# EAGLE design esp32_master_board (EAGLE 9.4.0)
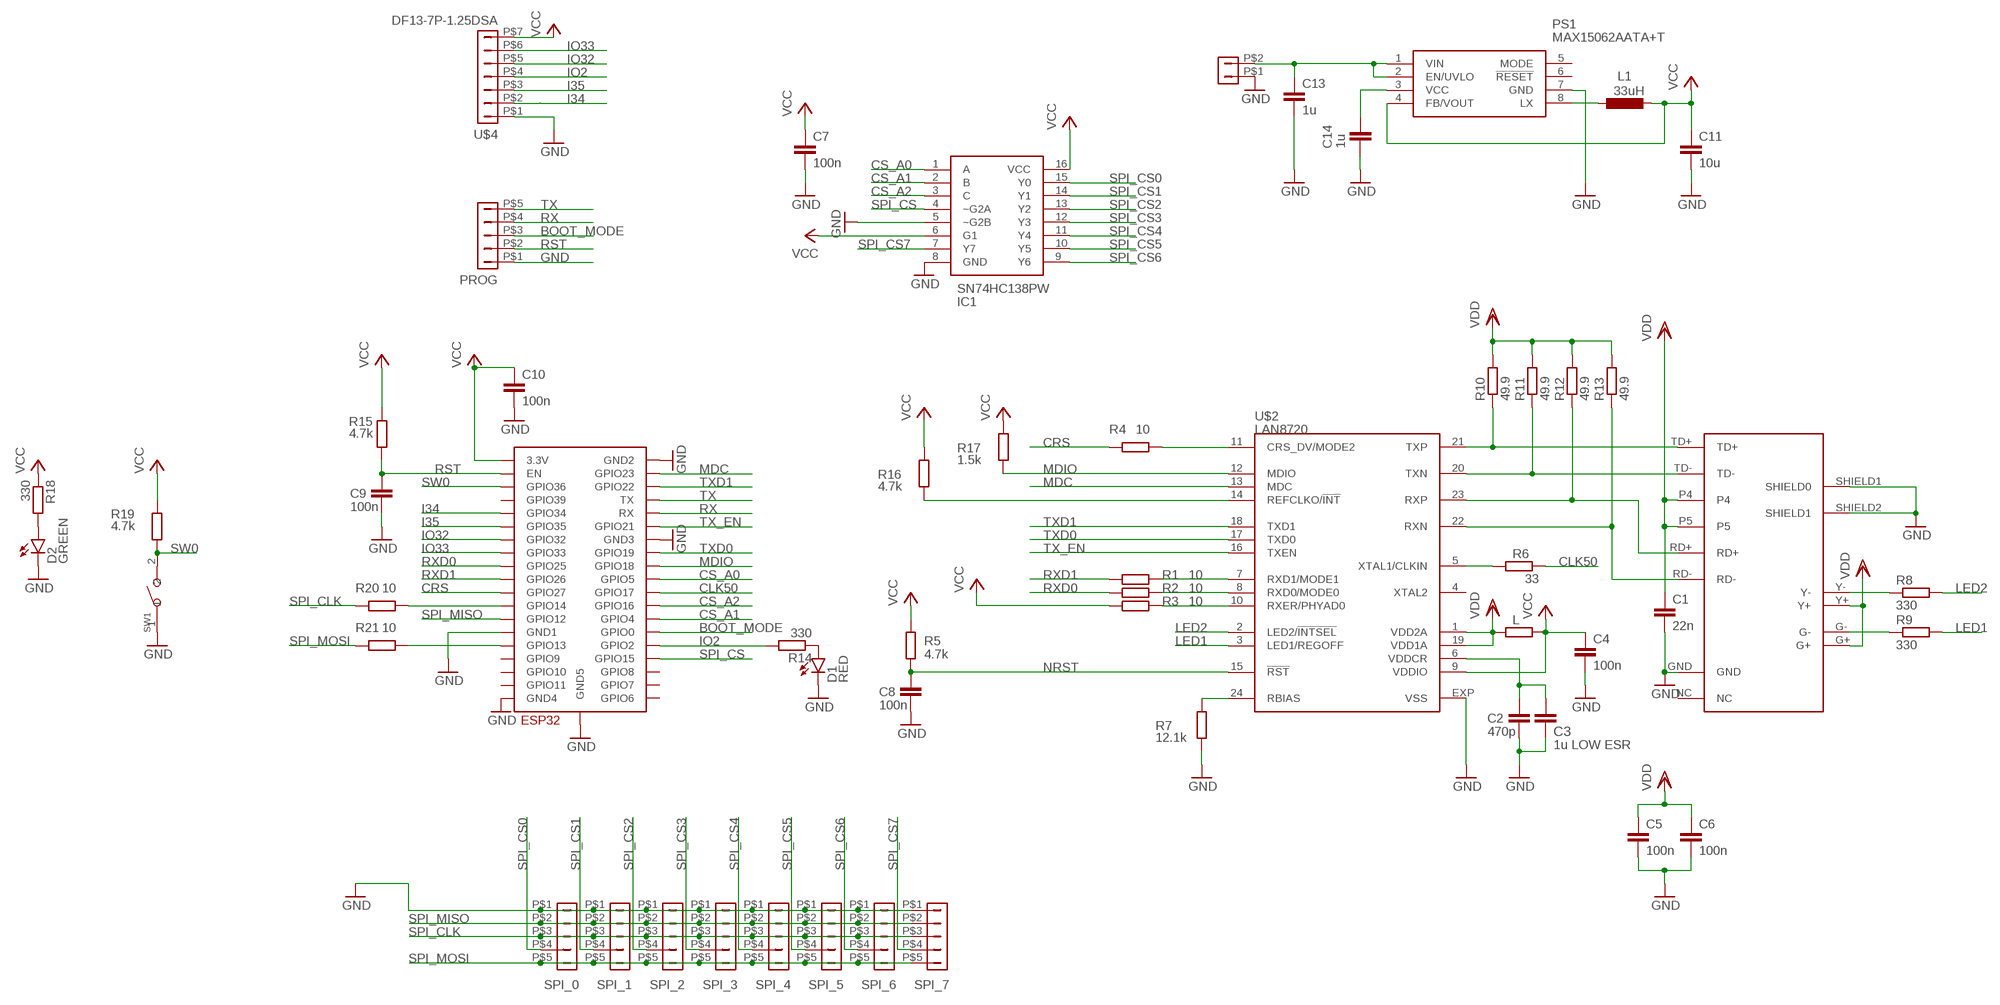
[diagram p0: schematic, sheet 1]

## Parts
C1  22n  C-EUC0402  [C0402]
C2  470p  C-EUC0402  [C0402]
C3  1u LOW ESR  C-EUC0402  [C0402]
C4  100n  C-EUC0402  [C0402]
C5  100n  C-EUC0402  [C0402]
C6  100n  C-EUC0402  [C0402]
C7  100n  C-EUC0402  [C0402]
C8  100n  C-EUC0402  [C0402]
C9  100n  C-EUC0402  [C0402]
C10  100n  C-EUC0805K  [C0805K]
C11  10u  C-EUC0805K  [C0805K]
C13  1u  C-EUC0805K  [C0805K]
C14  1u  C-EUC0402  [C0402]
D1  RED  LEDCHIPLED_0805  [CHIPLED_0805]
D2  GREEN  LEDCHIPLED_0805  [CHIPLED_0805]
IC1  SN74HC138PW  [SOP65P640X120-16N]
L  R-EU_R0402  [R0402]
L1  33uH  L-EUWE-TPC  [POWER-CHOKE_WE-TPC]
POWER  DF13-2P-1.25DSA  [DF13-2P-1.25DSA]
PROG  DF13-5P-1.25DSA  [DF13-5P-1.25DSA]
PS1  MAX15062AATA+T  [MAX14591ETAT]
R1  10  R-EU_R0402  [R0402]
R2  10  R-EU_R0402  [R0402]
R3  10  R-EU_R0402  [R0402]
R4  10  R-EU_R0402  [R0402]
R5  4.7k  R-EU_R0402  [R0402]
R6  33  R-EU_R0402  [R0402]
R7  12.1k  R-EU_R0402  [R0402]
R8  330  R-EU_R0402  [R0402]
R9  330  R-EU_R0402  [R0402]
R10  49.9  R-EU_R0402  [R0402]
R11  49.9  R-EU_R0402  [R0402]
R12  49.9  R-EU_R0402  [R0402]
R13  49.9  R-EU_R0402  [R0402]
R14  330  R-EU_R0402  [R0402]
R15  4.7k  R-EU_R0402  [R0402]
R16  4.7k  R-EU_R0402  [R0402]
R17  1.5k  R-EU_R0402  [R0402]
R18  330  R-EU_R0402  [R0402]
R19  4.7k  R-EU_R0402  [R0402]
R20  10  R-EU_R0402  [R0402]
R21  10  R-EU_R0402  [R0402]
SPI_0  DF13-5P-1.25DSA  [DF13-5P-1.25DSA]
SPI_1  DF13-5P-1.25DSA  [DF13-5P-1.25DSA]
SPI_2  DF13-5P-1.25DSA  [DF13-5P-1.25DSA]
SPI_3  DF13-5P-1.25DSA  [DF13-5P-1.25DSA]
SPI_4  DF13-5P-1.25DSA  [DF13-5P-1.25DSA]
SPI_5  DF13-5P-1.25DSA  [DF13-5P-1.25DSA]
SPI_6  DF13-5P-1.25DSA  [DF13-5P-1.25DSA]
SPI_7  DF13-5P-1.25DSA  [DF13-5P-1.25DSA]
SW1  B3U-1000P-2P-SMD  SMD-BUTTON(2P-3.0X2.5X1.2+0.4MM)-B3U-1000P-2P-SMD  [SW2-2.6-3.0X2.5X1.2+0.4MM]
U$1  ESP32-WROOM  [ESP32-WROOM]
U$2  LAN8720  [QFN24]
U$3  HR911105A  [RJ45]
U$4  DF13-7P-1.25DSA  [DF13-7P-1.25DSA]

## Nets
BOOT_MODE: PROG.P$3 U$1.IO0(GPIO0)
CLK50: R6.1 U$1.IO17(GPIO17)
CRS: R4.1 U$1.IO27(GPIO27)
CS_A0: IC1.1(A) U$1.IO5(GPIO5)
CS_A1: IC1.2(B) U$1.IO4(GPIO4)
CS_A2: IC1.3(C) U$1.IO16(GPIO16)
GND: C1.2 C2.2 C3.2 C4.2 C5.2 C6.2 C7.2 C8.2 C9.2 C10.2 C11.2 C13.2 C14.1 D1.C D2.C IC1.5(~G2B) IC1.8(GND) POWER.P$1 PROG.P$1 PS1.7(GND) R7.1 SPI_0.P$1 SPI_1.P$1 SPI_2.P$1 SPI_3.P$1 SPI_4.P$1 SPI_5.P$1 SPI_6.P$1 SPI_7.P$1 SW1.1 U$1.GND1 U$1.GND2 U$1.GND3 U$1.GND4 U$1.GND5 U$2.EXP(VSS) U$3.GND U$3.SHIELD1(SHIELD0) U$3.SHIELD2(SHIELD1) U$4.P$1
I34: U$1.IO34(GPIO34) U$4.P$2
I35: U$1.IO35(GPIO35) U$4.P$3
IO2: R14.2 U$1.IO2(GPIO2) U$4.P$4
IO32: U$1.IO32(GPIO32) U$4.P$5
IO33: U$1.IO33(GPIO33) U$4.P$6
LED1: R9.2 U$2.3(LED1/REGOFF)
LED2: R8.2 U$2.2(LED2/!INTSEL)
MDC: U$1.IO23(GPIO23) U$2.13(MDC)
MDIO: R17.1 U$1.IO18(GPIO18) U$2.12(MDIO)
N$1: R1.2 U$2.7(RXD1/MODE1)
N$2: R2.2 U$2.8(RXD0/MODE0)
N$3: R3.2 U$2.10(RXER/PHYAD0)
N$4: R4.2 U$2.11(CRS_DV/MODE2)
N$5: R6.2 U$2.5(XTAL1/CLKIN)
N$6: R7.2 U$2.24(RBIAS)
N$7: R10.1 U$2.21(TXP) U$3.TD+
N$8: R11.1 U$2.20(TXN) U$3.TD-
N$9: R12.1 U$2.23(RXP) U$3.RD+
N$10: R13.1 U$2.22(RXN) U$3.RD-
N$11: R8.1 U$3.Y-
N$12: R9.1 U$3.G-
N$13: R16.1 U$2.14(REFCLKO/!INT)
N$14: C2.1 C3.1 U$2.6(VDDCR)
N$15: C14.2 PS1.3(VCC)
N$16: D1.A R14.1
N$17: R21.2 U$1.IO13(GPIO13)
N$18: L1.1 PS1.8(LX)
N$19: C13.1 POWER.P$2 PS1.1(VIN) PS1.2(EN/UVLO)
N$20: D2.A R18.2
N$21: R20.2 U$1.IO14(GPIO14)
NRST: C8.1 R5.1 U$2.15(!RST)
RST: C9.1 PROG.P$2 R15.1 U$1.EN
RX: PROG.P$4 U$1.RX
RXD0: R2.1 U$1.IO25(GPIO25)
RXD1: R1.1 U$1.IO26(GPIO26)
SPI_CLK: R20.1 SPI_0.P$3 SPI_1.P$3 SPI_2.P$3 SPI_3.P$3 SPI_4.P$3 SPI_5.P$3 SPI_6.P$3 SPI_7.P$3
SPI_CS: IC1.4(~G2A) U$1.IO15(GPIO15)
SPI_CS0: IC1.15(Y0) SPI_0.P$4
SPI_CS1: IC1.14(Y1) SPI_1.P$4
SPI_CS2: IC1.13(Y2) SPI_2.P$4
SPI_CS3: IC1.12(Y3) SPI_3.P$4
SPI_CS4: IC1.11(Y4) SPI_4.P$4
SPI_CS5: IC1.10(Y5) SPI_5.P$4
SPI_CS6: IC1.9(Y6) SPI_6.P$4
SPI_CS7: IC1.7(Y7) SPI_7.P$4
SPI_MISO: SPI_0.P$2 SPI_1.P$2 SPI_2.P$2 SPI_3.P$2 SPI_4.P$2 SPI_5.P$2 SPI_6.P$2 SPI_7.P$2 U$1.IO12(GPIO12)
SPI_MOSI: R21.1 SPI_0.P$5 SPI_1.P$5 SPI_2.P$5 SPI_3.P$5 SPI_4.P$5 SPI_5.P$5 SPI_6.P$5 SPI_7.P$5
SW0: R19.1 SW1.2 U$1.SENSOR_VP(GPIO36)
TX: PROG.P$5 U$1.TX
TX_EN: U$1.IO21(GPIO21) U$2.16(TXEN)
TXD0: U$1.IO19(GPIO19) U$2.17(TXD0)
TXD1: U$1.IO22(GPIO22) U$2.18(TXD1)
VCC [power]: C4.1 C7.1 C10.1 C11.1 IC1.6(G1) IC1.16(VCC) L1.2 L.1 PS1.4(FB/VOUT) R3.1 R5.2 R15.2 R16.2 R17.2 R18.1 R19.2 U$1.3V3(3.3V) U$2.9(VDDIO) U$4.P$7
VDD [power]: C1.1 C5.1 C6.1 L.2 R10.2 R11.2 R12.2 R13.2 U$2.1(VDD2A) U$2.19(VDD1A) U$3.G+ U$3.P4 U$3.P5 U$3.Y+
Unconnected: PS1.5(MODE) PS1.6(!RESET) U$1.CLK(GPIO6) U$1.CMD(GPIO11) U$1.SD0(GPIO7) U$1.SD1(GPIO8) U$1.SD2(GPIO9) U$1.SD3(GPIO10) U$1.SENSOR_VN(GPIO39) U$2.4(XTAL2) U$3.NC

## Library data of the parts
C1-C11 C13 C14 = resistor:C-EU: CAPACITOR, European symbol
D1 D2 = led:LED: LED OSRAM: - CHIPLED LG R971, LG N971, LY N971, LG Q971, LY Q971, LO R971, LY R971 LH N974, LH R974 LS Q976, LO Q976, LY Q976 LO Q996 - Hyper CHIPLED LW Q18S LB Q993, LB Q99A, LB R99A - SideLED LS A670, LO A670, LY A670, LG A670, LP A670 LB A673, LV A673, LT A673, LW A673 LH A674 LY A675 LS A676, LA A676, LO A676, LY A676, LW A676 LS A679, LY A679, LG A679 - Hyper Micro SIDELED® LS Y876, LA Y876, LO Y876, LY Y876 LT Y87S - SmartLED LW L88C, LW L88S LB L89C, LB L89S, LG L890 LS L89K, LO L89K, LY L89K LS L896, LA L896, LO L896, LY L896 - TOPLED LS T670, LO T670, LY T670, LG T670, LP T670 LSG T670, LSP T670, LSY T670, LOP T670, LYG T670 LG T671, LOG T671, LSG T671 LB T673, LV T673, LT T673, LW T673 LH T674 LS T676, LA T676, LO T676, LY T676, LB T676, LH T676, LSB T676, LW T676 LB T67C, LV T67C, LT T67C, LS T67K, LO T67K, LY T67K, LW E67C LS E67B, LA E67B, LO E67B, LY E67B, LB E67C, LV E67C, LT E67C LW T67C LS T679, LY T679, LG T679 LS T770, LO T770, LY T770, LG T770, LP T770 LB T773, LV T773, LT T773, LW T773 LH T774 LS E675, LA E675, LY E675, LS T675 LS T776, LA T776, LO T776, LY T776, LB T776 LHGB T686 LT T68C, LB T68C - Hyper Mini TOPLED® LB M676 - Mini TOPLED Santana® LG M470 LS M47K, LO M47K, LY M47K Source: http://www.osram.convergy.de LUXEON: - LUMILED® LXK2-PW12-R00, LXK2-PW12-S00, LXK2-PW14-U00, LXK2-PW14-V00 LXK2-PM12-R00, LXK2-PM12-S00, LXK2-PM14-U00 LXK2-PE12-Q00, LXK2-PE12-R00, LXK2-PE12-S00, LXK2-PE14-T00, LXK2-PE14-U00 LXK2-PB12-K00, LXK2-PB12-L00, LXK2-PB12-M00, LXK2-PB14-N00, LXK2-PB14-P00, LXK2-PB14-Q00 LXK2-PR12-L00, LXK2-PR12-M00, LXK2-PR14-Q00, LXK2-PR14-R00 LXK2-PD12-Q00, LXK2-PD12-R00, LXK2-PD12-S00 LXK2-PH12-R00, LXK2-PH12-S00 LXK2-PL12-P00, LXK2-PL12-Q00, LXK2-PL12-R00 Source: www.luxeon.com KINGBRIGHT: KA-3528ASYC Source: www.kingbright.com
IC1 = SamacSys_Parts:SN74HC138PW: Texas Instruments SN74HC138PW, Decoder, Demultiplexer, 1-of-8, Inverting, 2 6 V, 16-Pin TSSOP Source: Datasheet <http://www.ti.com/lit/gpn/sn74hc138>; DESCRIPTION: Texas Instruments SN74HC138PW, Decoder, Demultiplexer, 1-of-8, Inverting, 2 6 V, 16-Pin TSSOP; HEIGHT: mm; MANUFACTURER_NAME: Texas Instruments; MANUFACTURER_PART_NUMBER: SN74HC138PW; RS_PART_NUMBER: 6631928; RS_PRICE-STOCK: https://uk.rs-online.com/web/p/products/6631928
L R1-R21 = resistor:R-EU_: RESISTOR, European symbol
L1 = resistor:L-EU: INDUCTOR, European symbol
POWER = con-hirose-df13:DF13-2P-1.25: DF13-2P 1.25mm Pitch Miniature Crimping Connector.
PROG SPI_0 SPI_1-SPI_7 = con-hirose-df13:DF13-5P-1.25: DF13-5P 1.25mm Pitch Miniature Crimping Connector.
PS1 = MAX15062AATA:MAX15062AATA+T: MAXIM INTEGRATED PRODUCTS - MAX15062AATA+T - DC/DC CTRL, SYNC BUCK, 500KHZ, TDFN-8 Source: Datasheet <https://componentsearchengine.com/Datasheets/1/MAX15062AATA T.pdf>; DESCRIPTION: MAXIM INTEGRATED PRODUCTS - MAX15062AATA+T - DC/DC CTRL, SYNC BUCK, 500KHZ, TDFN-8; HEIGHT: 0mm; MANUFACTURER_NAME: Maxim Integrated; MANUFACTURER_PART_NUMBER: MAX15062AATA+T; MOUSER_PART_NUMBER: 700-MAX15062AATA+T; MOUSER_PRICE-STOCK: https://www.mouser.com/Search/Refine.aspx?Keyword=700-MAX15062AATA%2BT
SW1 = OPL_Switch:SMD-BUTTON(2P-3.0X2.5X1.2+0.4MM): 311020047; MPN: B3U-1000P-2P-SMD
U$1 = ESP32:ESP32-WROOM
U$2 = microchip-smsc-lan8720:LAN8720: LAN8720A/LAN8720Ai Small Footprint RMII 10/100 Ethernet PHY Transceiver with HP Auto-MDIX Support from SMSC / Microchip <http://www.microchip.com>. (C) 2014 Tomasz Boleslaw CEDRO, cederom@tlen.pl, http://www.tomek.cedro.info. Version 0.1 (2014-01-04): Initial release.
U$3 = HR911105A:HR911105A
U$4 = con-hirose-df13:DF13-7P-1.25: DF13-7P 1.25mm Pitch Miniature Crimping Connector.

## Net classes
1 power: width 0.406 mm

## Board
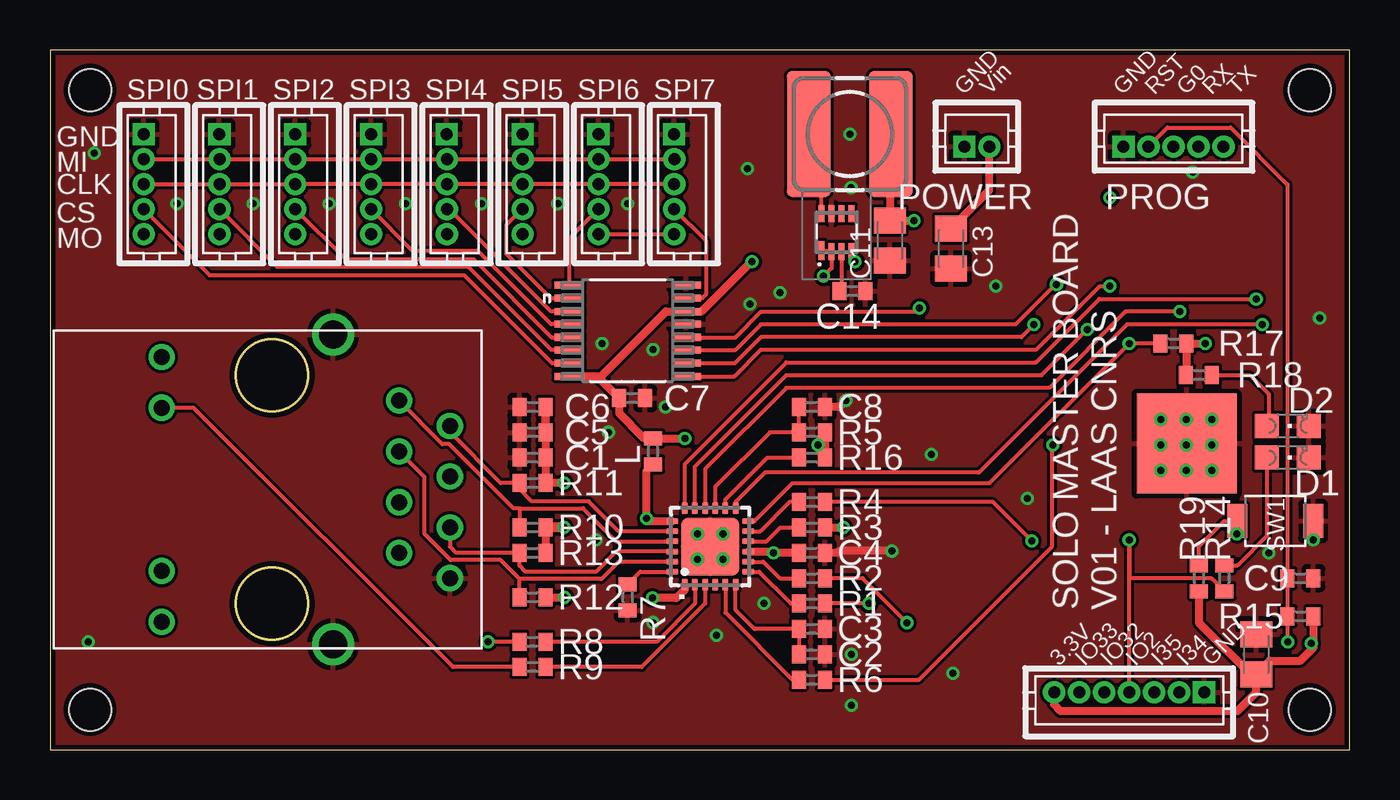
[diagram p1: board, top side]
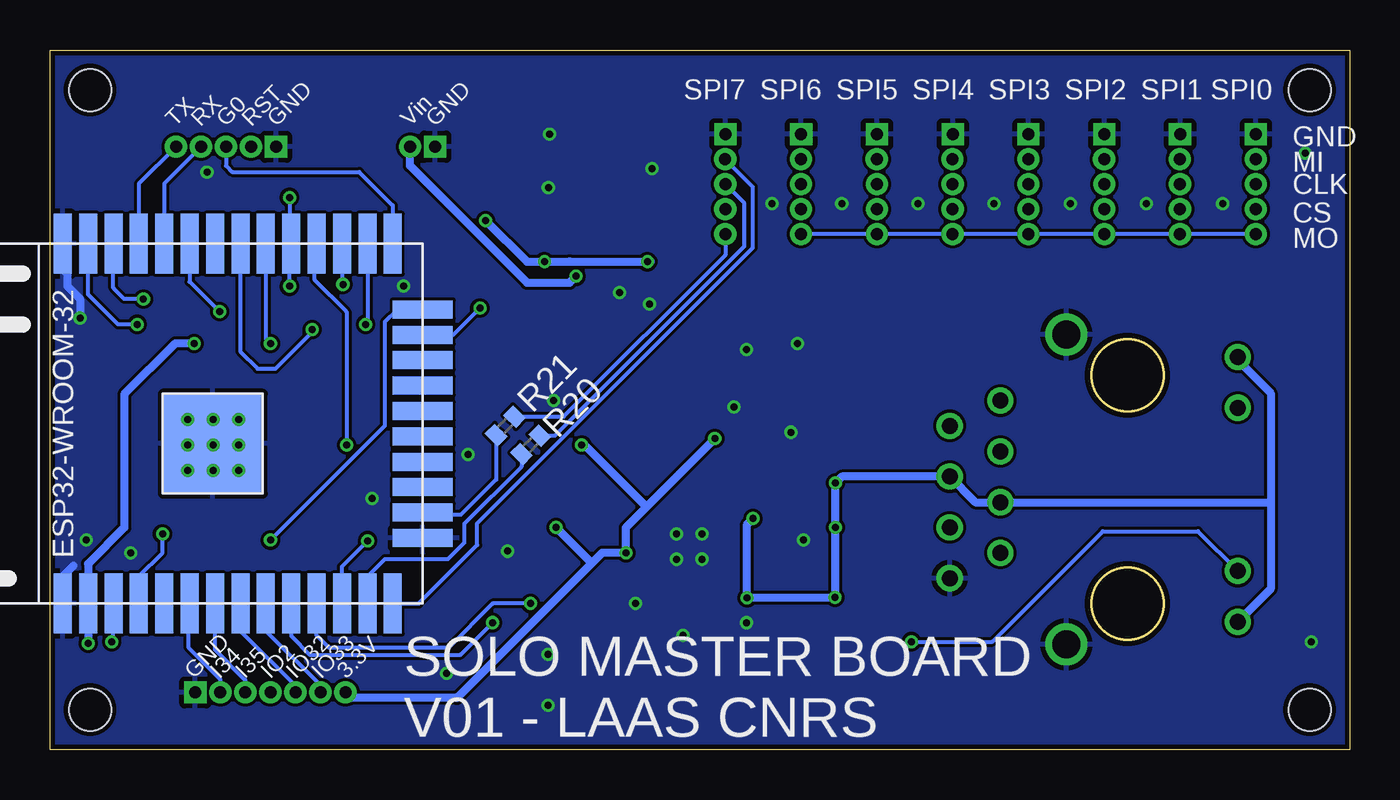
[diagram p2: board, bottom side, seen from below]

Size 65 x 35 mm. Coordinates in mm from the lower left corner, seen from the top.
Outline: 0,0 65,0 65,35 0,35 0,0
Copper layers (1*16): Top 0.035mm / dielectric 1.5mm / Bottom 0.035mm
Design rules "SeeedStudio": minimum track width 6mil, minimum drill 12mil, track to track 6mil, track to pad 6mil, pad to pad 6mil, via to via 6mil, smd to smd 0mil, copper to edge 10mil, drill to drill 10mil, minimum pad ring 10mil, minimum via ring 6mil, stop-mask expansion 2mil, vias tented up to drill 100mil, thermal gap 10mil
Holes 2.1 mm at 2,33 2,2 63,2 63,33

### Footprints (pad centres in the part's own frame; a part is rotated, then mirrored left to right if it is on the bottom)
C0402 = smd 0.7 x 0.9: 1 -0.65,0; 2 0.65,0
C0805K = smd 1.3 x 1.6: 1 -1,0; 2 1,0
CHIPLED_0805 = smd 1.2 x 1.2: A 0,-1.05; C 0,1.05
SOP65P640X120-16N = smd 1.473 x 0.356: 1 -2.921,2.286; 2 -2.921,1.626; 3 -2.921,0.965; 4 -2.921,0.33; 5 -2.921,-0.33; 6 -2.921,-0.965; 7 -2.921,-1.626; 8 -2.921,-2.286; 9 2.921,-2.286; 10 2.921,-1.626; 11 2.921,-0.965; 12 2.921,-0.33; 13 2.921,0.33; 14 2.921,0.965; 15 2.921,1.626; 16 2.921,2.286
R0402 = smd 0.7 x 0.9: 1 -0.65,0; 2 0.65,0
POWER-CHOKE_WE-TPC = smd 6.3 x 2.2: 1 0,2.05; 2 0,-2.05
DF13-2P-1.25DSA = drill 0.6 pad 1.016 square: P$1 0.625,0 | drill 0.6 pad 1.016: P$2 -0.625,0
DF13-5P-1.25DSA = drill 0.6 pad 1.016 square: P$1 2.5,0.005 | drill 0.6 pad 1.016: P$2 1.25,-0.005; P$3 0,0; P$4 -1.25,0; P$5 -2.5,0
MAX14591ETAT = smd 0.3 x 0.95: 1 -0.75,-0.762 | smd 0.3 x 0.85: 2 -0.25,-0.812; 3 0.25,-0.812; 4 0.75,-0.812; 5 0.75,1.088; 6 0.25,1.088; 7 -0.25,1.088; 8 -0.75,1.088
SW2-2.6-3.0X2.5X1.2+0.4MM = smd 1 x 1.7: 1 -1.9,0; 2 1.9,0
ESP32-WROOM = smd 3 x 0.9: 3V3 0,16.74; EN 0,15.47; GND1 0,18.01; GND3 18,18.01; IO0 18,1.5; IO4 18,2.77; IO5 18,6.58; IO12 0,1.5; IO14 0,2.77; IO16 18,4.04; IO17 18,5.31; IO18 18,7.85; IO19 18,9.12; IO21 18,11.66; IO22 18,15.47; IO23 18,16.74; IO25 0,6.58; IO26 0,5.31; IO27 0,4.04; IO32 0,9.12; IO33 0,7.85; IO34 0,11.66; IO35 0,10.39; NC 18,10.39; RX 18,12.93; SENSOR_VN 0,12.93; SENSOR_VP 0,14.2; TX 18,14.2 | smd 0.9 x 3: CLK 9.635,0; CMD 8.365,0; GND2 3.285,0; IO2 14.715,0; IO13 4.555,0; IO15 13.445,0; SD0 10.905,0; SD1 12.175,0; SD2 5.825,0; SD3 7.095,0 | smd 5 x 5: GND4 8,10.5 | smd 5 x 5 bottom: GND5 8,10.5
QFN24 = smd 0.6 x 0.3: 1 -1.905,1.27; 2 -1.905,0.762; 3 -1.905,0.254; 4 -1.905,-0.254; 5 -1.905,-0.762; 6 -1.905,-1.27; 13 1.905,-1.27; 14 1.905,-0.762; 15 1.905,-0.254; 16 1.905,0.254; 17 1.905,0.762; 18 1.905,1.27 | smd 0.3 x 0.6: 7 -1.27,-1.905; 8 -0.762,-1.905; 9 -0.254,-1.905; 10 0.254,-1.905; 11 0.762,-1.905; 12 1.27,-1.905; 19 1.27,1.905; 20 0.762,1.905; 21 0.254,1.905; 22 -0.254,1.905; 23 -0.762,1.905; 24 -1.27,1.905 | smd 2.9 x 2.9: EXP 0,0
RJ45 = drill 0.8: G+ 5.84,-6.305; G- 5.84,-3.765; GND -8.57,4.76; NC -6.03,3.5; P4 -8.57,-0.32; P5 -6.03,0.96; RD+ -6.03,-1.58; RD- -8.57,2.22; TD+ -6.03,-4.12; TD- -8.57,-2.86; Y+ 5.84,6.945; Y- 5.84,4.405 | drill 1.4: SHIELD1 -2.73,-7.425; SHIELD2 -2.73,8.065
DF13-7P-1.25DSA = drill 0.6 pad 1.016 square: P$1 3.75,0 | drill 0.6 pad 1.016: P$2 2.5,0; P$3 1.25,0; P$4 0,0; P$5 -1.25,0; P$6 -2.5,0; P$7 -3.75,0

### Placement (x,y rotation side)
C1  24.13,14.61 180 top
C2  38.1,4.76 0 top
C3  38.1,6.03 0 top
C4  38.1,9.84 0 top
C5  24.13,15.88 180 top
C6  24.13,17.14 180 top
C7  29.11,17.58 0 top
C8  38.1,17.14 0 top
C9  62.55,8.57 0 top
C10  60.33,4.76 90 top
C11  42.01,25.47 270 top
C13  45.07,25.07 270 top
C14  40.14,22.94 180 top
D1  61.91,14.61 270 top
D2  61.91,16.19 270 top
IC1  28.89,20.95 180 top
L  30.16,14.92 270 top
L1  40.01,30.8 90 top
POWER  46.35,30.16 180 top
PROG  56.2,30.16 180 top
PS1  39.34,25.74 0 top
R1  38.1,7.3 180 top
R2  38.1,8.57 180 top
R3  38.1,11.11 180 top
R4  38.1,12.38 180 top
R5  38.1,15.88 0 top
R6  38.1,3.49 180 top
R7  28.89,7.62 90 top
R8  24.13,5.4 0 top
R9  24.13,4.13 0 top
R10  24.13,11.11 0 top
R11  24.13,13.34 0 top
R12  24.13,7.62 0 top
R13  24.13,9.84 0 top
R14  58.74,8.57 270 top
R15  62.55,6.67 0 top
R16  38.1,14.61 0 top
R17  56.2,20.32 0 top
R18  57.47,18.73 0 top
R19  57.47,8.57 270 top
R20  40.96,15.24 225 bottom
R21  42.23,16.19 225 bottom
SPI_0  4.69,28.28 90 top
SPI_1  8.48,28.28 90 top
SPI_2  12.27,28.28 90 top
SPI_3  16.06,28.28 90 top
SPI_4  19.85,28.28 90 top
SPI_5  23.64,28.28 90 top
SPI_6  27.43,28.28 90 top
SPI_7  31.22,28.28 90 top
SW1  61.28,11.43 180 top
U$1  46.35,7.3 90 bottom
U$2  33.02,10.16 90 top
U$3  11.43,13.34 180 top
U$4  53.98,2.86 0 top

### Tracks (layer width: path | path; a pad name or v marks a point on that pad's centre or on a via)
BOOT_MODE
  Bottom 0.203: PROG.P$3 56.2,29.21 55.88,28.89 49.53,28.89 47.85,27.22 U$1.IO0
CLK50  (via drill 0.35)
  Top 0.203: v50.16,15.24 50.13,15.21 50.13,10.17 43.46,3.49 R6.1
  Bottom 0.203: v50.16,15.24 50.16,21.91 51.75,23.5 51.75,25.21 U$1.IO17
CRS  (via drill 0.35)
  Top 0.203: R4.1 47.17,12.38 v49.11,10.45
  Bottom 0.203: v49.11,10.45 50.4,9.16 U$1.IO27
CS_A0  (via drill 0.35)
  Top 0.203: IC1.1 34.23,18.67 35.56,20 49.33,20 52.5,23.18 v53.02,23.18
  Bottom 0.203: v53.02,27.62 53.02,25.39 U$1.IO5 53.02,25.21 v53.02,23.18
CS_A1  (via drill 0.35)
  Top 0.203: IC1.2 34.25,19.33 35.56,20.64 48.58,20.64 v49.21,21.27
  Bottom 0.203: U$1.IO4 49.12,21.36 v49.21,21.27
CS_A2  (via drill 0.35)
  Top 0.203: IC1.3 34.28,19.99 35.56,21.27 48.29,21.27 50.29,23.27 v50.35,23.27
  Bottom 0.203: U$1.IO16 50.4,23.32 v50.35,23.27
GND  (via drill 0.35)
  Top 0.406: U$2.EXP v32.38,10.79 | U$2.EXP v33.66,9.53 | U$2.EXP v32.38,9.53 | U$2.EXP v33.66,10.79 | v42.11,9.93 39.47,9.93 39.38,9.84 C4.2 | v39.81,17.46 39.49,17.14 C8.2
  Bottom 0.203: U$1.GND1 64.36,8.66 | U$1.GND3 64.36,24.04 | U$1.GND4 56.9,15.3 v58.1,16.51 | U$1.GND4 55.65,16.51 v55.56,16.51 | U$1.GND4 55.56,14.01 v55.56,13.97 | U$1.GND4 58.1,14.05 v58.1,13.97
  Bottom 0.406: 64.36,8.66 63.82,9.21 | 64.36,24.04 64.14,23.81 64.14,23.18 63.5,22.54 v63.5,21.59
  other vias: 56.83,15.24 56.83,16.51 55.56,15.24 56.83,13.97 58.1,15.24 47.31,23.18 63.18,10.48 57.15,28.89 34.89,29.06 40.01,30.8 2.22,29.84 1.91,5.4 33.34,5.71 27.62,20.32 27.94,15.88 35.01,22.29 30.8,17.14 60.96,9.84 27.3,10.48 36.51,22.86 40.07,28.11 40.08,4.76 48.88,12.55 44.08,14.76 6.35,27.3 10.16,27.3 13.97,27.3 17.78,27.3 21.59,27.3 25.4,27.3 28.89,27.3 35.72,7.3 30.16,6.35 40.08,2.22 45.16,3.8 30.16,20
  pour Top: 0,35 65,35 65,0 0,0
  pour Bottom: 0,35 65,35 65,0 0,0
I34
  Bottom 0.203: U$4.P$2 56.48,3.51 58.08,5.12 58.08,7.23 U$1.IO34
I35
  Bottom 0.203: U$4.P$3 55.23,3.47 56.74,4.99 U$1.IO35
IO2  (via drill 0.35)
  Top 0.203: R14.2 58.1,8.56 53.98,8.56 v53.98,10.48 53.95,10.48 53.95,2.88 U$4.P$4
  Bottom 0.203: U$1.IO2 47.62,22.02 48.26,21.38 48.26,16.19 v53.98,10.48
IO32
  Bottom 0.203: U$1.IO32 55.48,5.95 52.73,3.2 U$4.P$5
IO33
  Bottom 0.203: U$1.IO33 54.2,5.95 51.48,3.22 U$4.P$6
LED1
  Top 0.203: U$2.3 32.77,7.3 29.59,4.13 R9.2
LED2
  Top 0.203: U$2.2 32.26,7.3 30.35,5.4 R8.2
MDC  (via drill 0.35)
  Top 0.203: v60.64,21.27 53.87,21.27 46.46,13.86 35.76,13.86 34.29,12.38 U$2.13
  Bottom 0.203: v60.64,21.27 61.59,21.27 63.09,22.77 U$1.IO23
MDIO  (via drill 0.35)
  Top 0.203: U$2.12 35.24,11.43 37.15,13.34 46.99,13.34 v53.98,20.32 R17.1
  Bottom 0.203: U$1.IO18 54.2,20.55 v53.98,20.32
N$1
  Top 0.203: R1.2 37.05,7.3 35.47,8.89 U$2.7
N$2
  Top 0.203: U$2.8 35.69,9.4 36.51,8.57 R2.2
N$3
  Top 0.203: U$2.10 35.84,10.41 36.54,11.11 R3.2
N$4
  Top 0.203: U$2.11 35.53,10.92 36.99,12.38 R4.2
N$5
  Top 0.203: R6.2 37.15,3.49 33.78,6.86 U$2.5
N$6
  Top 0.203: R7.2 29.51,8.89 U$2.24
N$7
  Top 0.203: U$2.21 28.32,10.41 26.67,12.06 23.5,12.06 | 23.5,12.06 23.5,11.13 R10.1 | 23.5,12.06 23.18,12.06 19.96,15.29 19.62,15.29 U$3.TD+
N$8
  Top 0.203: U$2.20 28.45,10.92 26.95,12.42 24.09,12.42 23.48,13.03 R11.1 22.54,13.34 20,15.88 U$3.TD-
N$9
  Top 0.203: U$2.23 28.45,9.4 27.58,8.53 23.5,8.53 | U$3.RD+ 18.73,13.64 18.73,10.79 20.04,9.48 22.54,9.48 23.5,8.53 | R12.1 23.5,7.63 23.5,8.53
N$10
  Top 0.203: U$2.22 28.32,9.91 27.31,8.89 23.8,8.89 23.48,9.21 R13.1 20.32,9.84 20,10.16 U$3.RD-
N$11  (via drill 0.35)
  Top 0.203: R8.1 v21.91,5.4
  Bottom 0.203: v21.91,5.4 17.86,5.4 12.35,10.92 7.58,10.92 U$3.Y-
N$12
  Top 0.203: R9.1 20.15,4.13 7.18,17.1 U$3.G-
N$13
  Top 0.203: U$2.14 33.78,12.51 35.88,14.61 R16.1
N$14
  Top 0.203: C2.1 C3.1 35.24,6.03 34.29,6.99 U$2.6
N$15
  Top 0.203: C14.2 39.59,23.04 PS1.3
N$16
  Top 0.203: D1.A 60.86,10.68 59.4,9.22 R14.1
N$17
  Bottom 0.203: R21.2 42.69,13.51 44.45,11.75 46.24,11.75 U$1.IO13
N$18
  Top 0.203: PS1.8 38.59,30.16
  Top 0.406: 38.59,30.16 L1.1
N$19  (via drill 0.35)
  Top 0.203: v38.69,23.68 39.09,24.08 PS1.2 39.04,24.98 PS1.1
  Top 0.406: C13.1 46.98,27.98 POWER.P$2
  Bottom 0.406: v38.69,23.68 39.01,23.36 41.14,23.36 46.99,29.21 POWER.P$2
N$20
  Top 0.203: D2.A 60.96,16.29 60.96,17.78 60.01,18.73 R18.2
N$21
  Bottom 0.203: R20.2 41.42,14.14 44.28,11.28 44.28,10.35 45.11,9.53 48.26,9.53 49.12,8.66 U$1.IO14
NRST
  Top 0.203: C8.1 R5.1 36.01,15.88 33.27,13.14 U$2.15
RST  (via drill 0.35)
  Top 0.203: PROG.P$2 55.9,31.11 59.05,31.11 61.9,28.27 C9.1 R15.1 61.9,5.41
  Top 0.406: 61.9,5.41 v61.91,5.4
  Bottom 0.203: 61.83,5.49 U$1.EN
  Bottom 0.406: v61.91,5.4 61.83,5.49
RX
  Bottom 0.203: PROG.P$4 59.28,28.32 U$1.RX
RXD0  (via drill 0.35)
  Top 0.203: R2.1 40.64,8.57 v42.86,6.35
  Bottom 0.203: v42.86,6.35 44.47,4.74 52,4.74 52.94,5.68 U$1.IO25
RXD1  (via drill 0.35)
  Top 0.203: v40.96,7.3 R1.1
  Bottom 0.203: v40.96,7.3 42.86,7.3 45.07,5.1 51.05,5.1 51.66,5.71 U$1.IO26
SPI_CLK
  Top 0.203: SPI_7.P$3 SPI_6.P$3 SPI_5.P$3 SPI_4.P$3 SPI_3.P$3 SPI_2.P$3 SPI_1.P$3 SPI_0.P$3
  Bottom 0.203: SPI_7.P$3 30.27,27.33 30.27,25.19 39.76,15.7 R20.1
SPI_CS  (via drill 0.35)
  Top 0.203: IC1.4 34.28,20.62 35.56,21.91 43.5,21.91 v43.5,22.09
  Bottom 0.203: v43.5,22.09 44.87,20.72 46.32,20.72 U$1.IO15
SPI_CS0
  Top 0.203: IC1.15 25.12,19.33 20.72,23.73 7.99,23.73 SPI_0.P$4
SPI_CS1
  Top 0.203: IC1.14 25.09,19.99 20.91,24.17 11.34,24.17 SPI_1.P$4
SPI_CS2
  Top 0.203: IC1.13 25.09,20.62 21.2,24.52 14.78,24.52 SPI_2.P$4
SPI_CS3
  Top 0.203: IC1.12 25.07,21.29 21.38,24.98 18.12,24.98 SPI_3.P$4
SPI_CS4
  Top 0.203: IC1.11 25.07,21.92 19.96,27.03 SPI_4.P$4
SPI_CS5
  Top 0.203: IC1.10 25.04,22.58 22.83,24.79 22.83,26.25 23.61,27.03 SPI_5.P$4
SPI_CS6
  Top 0.203: SPI_6.P$4 25.97,25.57 IC1.9
SPI_CS7
  Top 0.203: IC1.7 32.61,22.58 32.8,22.77 32.8,25.45 SPI_7.P$4
SPI_MISO
  Top 0.203: SPI_0.P$2 SPI_1.P$2 SPI_2.P$2 SPI_3.P$2 SPI_4.P$2 SPI_5.P$2 SPI_6.P$2 SPI_7.P$2
  Bottom 0.203: U$1.IO12 46.56,7.3 43.63,10.23 43.63,11.32 29.84,25.11 29.84,28.14 SPI_7.P$2
SPI_MOSI
  Top 0.203: SPI_6.P$5 SPI_7.P$5
  Bottom 0.203: SPI_0.P$5 SPI_1.P$5 SPI_2.P$5 SPI_3.P$5 SPI_4.P$5 SPI_5.P$5 SPI_6.P$5 | SPI_7.P$5 31.22,24.74 39.31,16.65 R21.1
SW0  (via drill 0.35)
  Top 0.203: R19.1 57.47,10.16 58.74,11.43 SW1.2 v59.38,10.8 v59.37,10.79
  Bottom 0.203: U$1.SENSOR_VP 60.55,8.66 59.37,9.84 v59.37,10.79
TX
  Bottom 0.203: PROG.P$5 60.55,28.3 U$1.TX
TX_EN  (via drill 0.35)
  Top 0.203: U$2.16 32.77,14.03 36.83,18.1 49.99,18.1 53.8,21.91 v56.52,21.91
  Bottom 0.203: v56.52,21.91 58.02,23.41 U$1.IO21
TXD0  (via drill 0.35)
  Top 0.203: U$2.17 32.26,14.16 36.83,18.73 49.59,18.73 51.87,21.01 v51.89,21.01
  Bottom 0.203: U$1.IO19 55.48,19.91 54.61,19.05 53.71,19.05 51.89,20.88 v51.89,21.01
TXD1  (via drill 0.35)
  Top 0.203: U$2.18 31.75,14.29 36.83,19.37 49.3,19.37 52.48,22.54 v60.33,22.54
  Bottom 0.203: v60.33,22.54 61.28,22.54 61.83,23.09 U$1.IO22
VCC  (via drill 0.35)
  Top 0.203: PS1.4 40.09,24.59 v40.27,24.4
  Top 0.406: U$2.9 36.13,9.91 v36.2,9.84 C4.1 | v31.75,15.56 30.18,15.56 L.1 29.72,15.57 28.46,16.83 C7.1 27.56,18.48 27.56,18.67 | R3.1 v39.69,11.11 | v57.78,20.32 R17.2 56.85,18.76 R18.1 | R5.2 38.75,15.24 | 38.75,15.24 R16.2 | v38.41,15.24 38.75,15.24 | 27.56,18.67 IC1.16 | U$4.P$7 50.23,2.25 50.54,1.94 59.41,1.94 60.33,2.85 60.33,3.49 | L1.2 42.01,30.75 C11.1 v43.2,26.47 | v35.12,24.4 35.08,24.4 32.6,21.92 IC1.6 30.81,21.92 27.56,18.67 | R15.2 63.2,5.41 | 63.2,5.41 v63.09,5.31 | 63.2,5.41 63.2,5.09 62.55,4.45 61.01,4.45 C10.1 60.33,3.49 | R19.2 57.47,6.35 60.33,3.49
  Bottom 0.406: 35.17,12.14 v31.75,15.56 | 35.17,12.14 38.27,15.24 v38.41,15.24 | v63.09,5.31 U$1.3V3 63.09,9.29 61.28,11.11 61.28,17.78 58.74,20.32 v57.78,20.32 | v43.2,26.47 41.14,24.4 v40.27,24.4 39,24.4 38.99,24.41 34.95,24.41 34.94,24.4 v35.12,24.4 | U$4.P$7 49.95,2.58 44.64,2.58 37.95,9.28 | 37.95,9.28 37.38,9.84 v36.2,9.84 36.2,11.11 35.17,12.14 | 37.95,9.28 37.95,9.37 v39.69,11.11
VDD  (via drill 0.35)
  Top 0.406: C5.1 C6.1 C1.1 R11.2 v25.72,13.34 | L.2 29.84,13.96 v29.84,11.55 29.97,11.43 U$2.19 | R10.2 R13.2 | R12.2 v25.73,7.62 | U$2.1 31.75,8.01 31.33,7.59 v30.13,7.59
  Top 0.508: v25.72,11.11 R10.2
  Bottom 0.406: v30.13,7.59 30.16,7.62 | 30.16,7.62 30.16,11.24 v29.84,11.55 | 30.16,7.62 v25.73,7.62 25.72,7.63 v25.72,11.11 v25.72,13.34 25.4,13.65 U$3.P4 18.72,12.38 U$3.P5 3.94,12.38 | U$3.G+ 5.59,19.48 3.94,17.84 3.94,12.38 | U$3.Y+ 3.94,8.04 3.94,12.38

### Text on the board
tPlace: SPI0 | SPI1 | SPI2 | SPI3 | SPI4 | SPI5 | SPI6 | SPI7 | GND | Vin | GND | RST | G0 | RX | TX | GND | MI | CLK | CS | MO | SOLO MASTER BOARD / V01 - LAAS CNRS | 3.3V | IO33 | IO32 | IO2 | I35 | I34 | GND
bPlace: SPI0 | SPI1 | SPI2 | SPI3 | SPI4 | SPI5 | SPI6 | SPI7 | GND | Vin | GND | RST | G0 | RX | TX | GND | MI | CLK | CS | MO | 3.3V | IO33 | IO32 | IO2 | I35 | I34 | GND | SOLO MASTER BOARD / V01 - LAAS CNRS
tNames: .